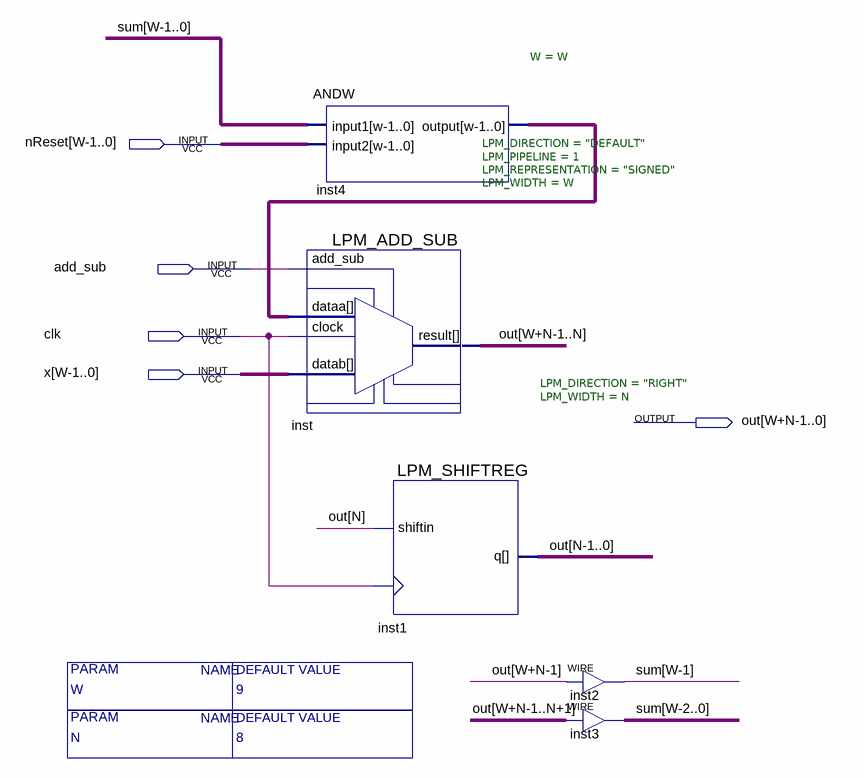
[diagram p0: schematic sheet]
// Quartus schematic MAC.bdf as structural Verilog: 5 symbols, 5 pins
module MAC #(parameter W = 9, parameter N = 8) (
  input  [8:0] nReset,
  input  add_sub,
  input  clk,
  input  [8:0] x,
  output [16:0] out
);

  wire [8:0] inst4_output, sum;

  ANDW #(.W(W)) inst4 (.input1(sum), .input2(nReset), .\output (inst4_output));
  LPM_ADD_SUB #(.LPM_DIRECTION("DEFAULT"), .LPM_PIPELINE(1), .LPM_REPRESENTATION("SIGNED"), .LPM_WIDTH(W)) inst (
    .datab(x), .add_sub(add_sub), .dataa(inst4_output), .clock(clk), .result(out[16:8]));
  LPM_SHIFTREG #(.LPM_DIRECTION("RIGHT"), .LPM_WIDTH(N)) inst1 (.shiftin(out[8]), .clock(clk), .q(out[7:0]));
  assign sum[8] = out[16];  // WIRE inst2
  assign sum[7:0] = out[16:9];  // WIRE inst3
endmodule
